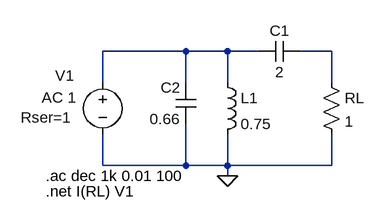
[diagram p0: schematic ej1_b.asc]
ej1_b.asc, the LTspice schematic file:
Version 4
SHEET 1 880 680
WIRE 144 112 16 112
WIRE 208 112 144 112
WIRE 256 112 208 112
WIRE 368 112 320 112
WIRE 16 160 16 112
WIRE 144 160 144 112
WIRE 208 160 208 112
WIRE 368 160 368 112
WIRE 16 288 16 240
WIRE 144 288 144 224
WIRE 144 288 16 288
WIRE 208 288 208 240
WIRE 208 288 144 288
WIRE 368 288 368 240
WIRE 368 288 208 288
WIRE 208 304 208 288
FLAG 208 304 0
SYMBOL voltage 16 144 R0
WINDOW 0 -73 5 Left 2
WINDOW 123 -94 39 Left 2
WINDOW 39 -126 70 Left 2
SYMATTR InstName V1
SYMATTR Value ""
SYMATTR Value2 AC 1
SYMATTR SpiceLine Rser=1
SYMBOL cap 320 96 R90
WINDOW 0 0 32 VBottom 2
WINDOW 3 32 32 VTop 2
SYMATTR InstName C1
SYMATTR Value 2
SYMBOL cap 160 224 R180
WINDOW 0 24 56 Left 2
WINDOW 3 24 8 Left 2
SYMATTR InstName C2
SYMATTR Value 0.66
SYMBOL res 352 144 R0
SYMATTR InstName RL
SYMATTR Value 1
SYMBOL ind 192 144 R0
SYMATTR InstName L1
SYMATTR Value 0.75
TEXT -72 304 Left 2 !.ac dec 1k 0.01 100
TEXT -72 328 Left 2 !.net I(RL) V1

The netlist it stands for:
* ej1_b.asc
V1 N001 0 AC 1 Rser=1
C1 N002 N001 2
C2 0 N001 0.66
RL N002 0 1
L1 N001 0 0.75
.ac dec 1k 0.01 100
.net I(RL) V1
.backanno
.end